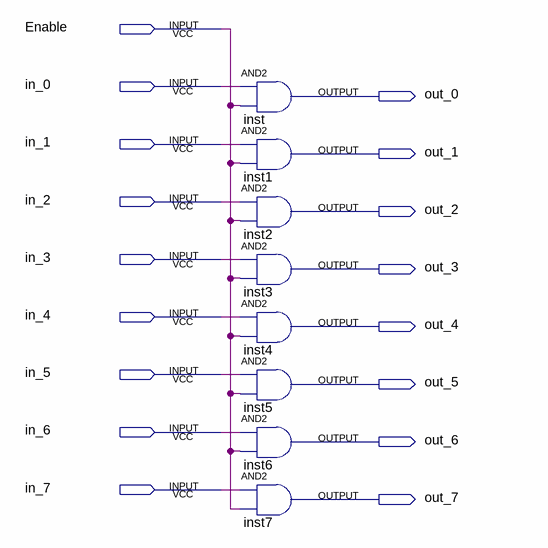
[diagram p0: schematic sheet]
// Quartus schematic 8-bit-tri-state-buffer.bdf as structural Verilog: 8 symbols, 17 pins
module \8-bit-tri-state-buffer  (
  input  Enable,
  input  in_0,
  input  in_1,
  input  in_2,
  input  in_3,
  input  in_4,
  input  in_5,
  input  in_6,
  input  in_7,
  output out_0,
  output out_1,
  output out_2,
  output out_3,
  output out_4,
  output out_5,
  output out_6,
  output out_7
);

  and inst (out_0, in_0, Enable);
  and inst1 (out_1, in_1, Enable);
  and inst2 (out_2, in_2, Enable);
  and inst3 (out_3, in_3, Enable);
  and inst4 (out_4, in_4, Enable);
  and inst5 (out_5, in_5, Enable);
  and inst6 (out_6, in_6, Enable);
  and inst7 (out_7, in_7, Enable);
endmodule
